# Altium schematic sheet RS422_driver.SchDoc
size A4; SheetNumber: 4; SheetTotal: 8
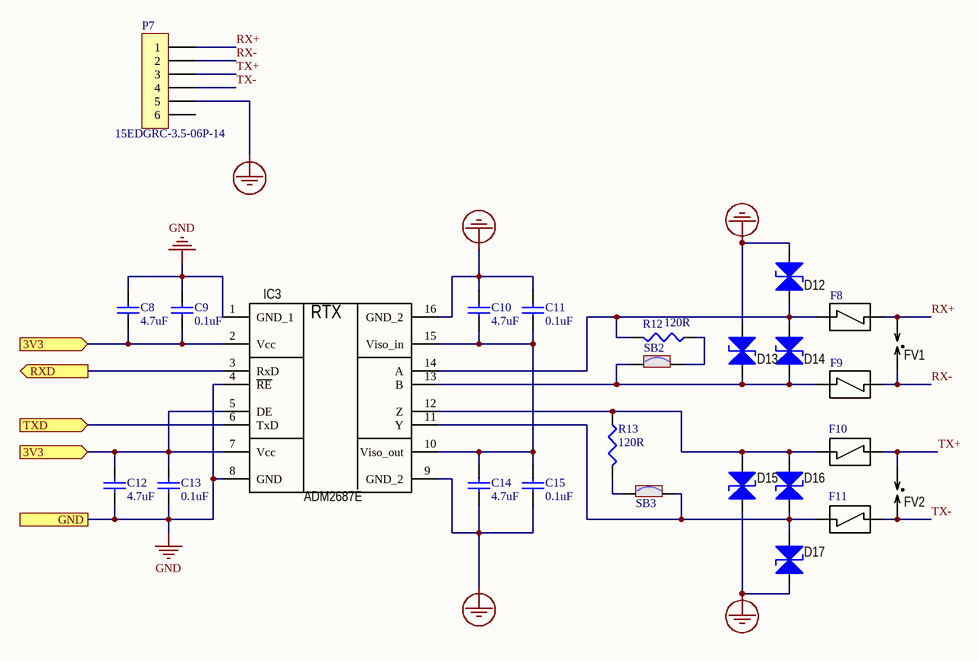
[diagram p0: RS422_driver.SchDoc]

## Parts
C8  4.7uF  [C1608-0603]
C9  0.1uF  [C1608-0603]
C10  4.7uF  [C1608-0603]
C11  0.1uF  [C1608-0603]
C12  4.7uF  [C1608-0603]
C13  0.1uF  [C1608-0603]
C14  4.7uF  [C1608-0603]
C15  0.1uF  [C1608-0603]
D12  SMBJ5.0CA  [SMB_H]  (value not drawn)
D13  SMBJ5.0CA  [SMB_H]  (value not drawn)
D14  SMBJ5.0CA  [SMB_H]  (value not drawn)
D15  SMBJ5.0CA  [SMB_H]  (value not drawn)
D16  SMBJ5.0CA  [SMB_H]  (value not drawn)
D17  SMBJ5.0CA  [SMB_H]  (value not drawn)
F8  TBU-CA065-200-WH  [TBU_CA]  (value not drawn)
F9  TBU-CA065-200-WH  [TBU_CA]  (value not drawn)
F10  TBU-CA065-200-WH  [TBU_CA]  (value not drawn)
F11  TBU-CA065-200-WH  [TBU_CA]  (value not drawn)
FV1  NS2R-75A1-M  [NS2R-xxx-x]  (value not drawn)
FV2  NS2R-75A1-M  [NS2R-xxx-x]  (value not drawn)
IC3  ADM2687E  [SO16_WIDE(300mil)_13x10_H]
P7  15EDGRC-3.5-06P-14  [15EDGRC-3.5-06P-14]
R12  120R  [R1608-0603]
R13  120R  [R1608-0603]
SB2  (no value)  [SOLDER-BRIDGE_R0603-0R]  (no BOM)
SB3  (no value)  [SOLDER-BRIDGE_R0603-0R]  (no BOM)

## Ports
3V3 (in), GND, RXD (out), TXD (in)

## Nets
GND: C8.2 C9.2 C12.1 C13.1 IC3.1(GND_1) IC3.4(~{RE}) IC3.8(GND) ; port GND
GND_line: C10.2 C11.2 C14.1 C15.1 D12.1(K) D13.1(K) D15.1(K) D17.1(K) IC3.9(GND_2) IC3.16(GND_2) P7.5
3V3: C8.1 C9.1 C12.2 C13.2 IC3.2(Vcc) IC3.5(DE) IC3.7(Vcc) ; port 3V3
RX+: F8.1 FV1.2(L) P7.1
RX-: F9.1 FV1.1(R) P7.2
RXD: IC3.3(RxD) ; port RXD
TX+: F10.1 FV2.1(R) P7.3
TX-: F11.1 FV2.2(L) P7.4
TXD: IC3.6(TxD) ; port TXD
NetC10_1: C10.1 C11.1 C14.2 C15.2 IC3.10(Viso_out) IC3.15(Viso_in)
NetD12_2: D12.2(A) D14.1(K) F8.0 IC3.14(A) R12.2
NetD13_2: D13.2(A) D14.2(A) F9.0 IC3.13(B) SB2.1
NetD15_2: D15.2(A) D16.2(A) F10.0 IC3.12(Z) R13.2
NetD16_1: D16.1(K) D17.2(A) F11.0 IC3.11(Y) SB3.1
NetR12_1: R12.1 SB2.2
NetR13_1: R13.1 SB3.2

Not connected (* = marked no-connect by the designer): P7 6

## Notes on the sheet
- (in symbol ADM2687E) RTX

## Library data of the parts
C8-C15 = Cap: Керамическийконденсатор; Корпус: 0603 (1608 Metric); Диэлектрик: X5R; Напряжение: 16B; Вид монтажа: SMD; Температурный диапазон: -55 ~ 100; Тип элемента: Керамический конденсатор
  C8 C10 C12 C14: Номинал: 4.7uF
  C9 C11 C13 C15: Номинал: 0.1uF
D12-D17 = SMBJ_CА: Супрессор двунаправленный; Производитель: ST MICROELECTRONICS CO., LTD.; Корпус: DO-214AA, SMB; Номинал: 5В; Вид монтажа: SMD; Тип элемента: Защитный диод; Температурный диапазон: -55°C ~ 150°C; Название: SMBJ5.0CA; Артикул: SMBJ5.0CA; ComponentLink: http://www.digikey.com/product-detail/en/SMBJ5.0CA/SMBJ5.0CABTR-ND/2254207
F8-F11 = TBU-CA: Самовосстанавливающийся предохранитель; Производитель: Bourns; Корпус: DFN; Номинал: 0.4A; Вид монтажа: SMD; Температурный диапазон: -40 to +125 °C; Название: TBU-CA065-200-WH; Артикул: TBU-CA065-200-WH; Тип элемента: Самовосстанавливающийся предохранитель
FV1 FV2 = NS2R-xxx-x_1: Газовый разрядник двухэлектродный; Номинал: 75В; Название: NS2R-75A1-M; Артикул: NS2R-75A1-M; Напряжение: 75В; Тип элемента: разрядник двухэлектродный
IC3 = ADM2687E: RS-485 Трансивер изолированный; Производитель: Analog Devices; Корпус: SOIC16; Вид монтажа: SMD; Тип элемента: Драйвер интерфейса RS-485, RS-422; Температурный диапазон: -40°C ~ 85°C; Артикул: ADM2687E; Название: ADM2687E
P7 = 15EDGRC-3.5-06P-14: Разъем штыревой на плату (папа); Производитель: Degson; Номинал: 8А; Напряжение: 300В; Вид монтажа: DIP; Температурный диапазон: -40℃~105℃; Примечание: шаг 3.5 мм; Название: 15EDGRC-3.5-06P-14; Артикул: 15EDGRC-3.5-06P-14; Тип элемента: Разъем
R12 R13 = resistor: SMD резистор; Производитель: 1%; Корпус: 0603 (1608 Metric); Номинал: 120R; Точность: 1%; Название: Резистор; Вид монтажа: SMD; Тип элемента: Резистор
SB2 SB3 = SB: Перемычка